# EAGLE design SlideBoard (EAGLE 7.5.0)
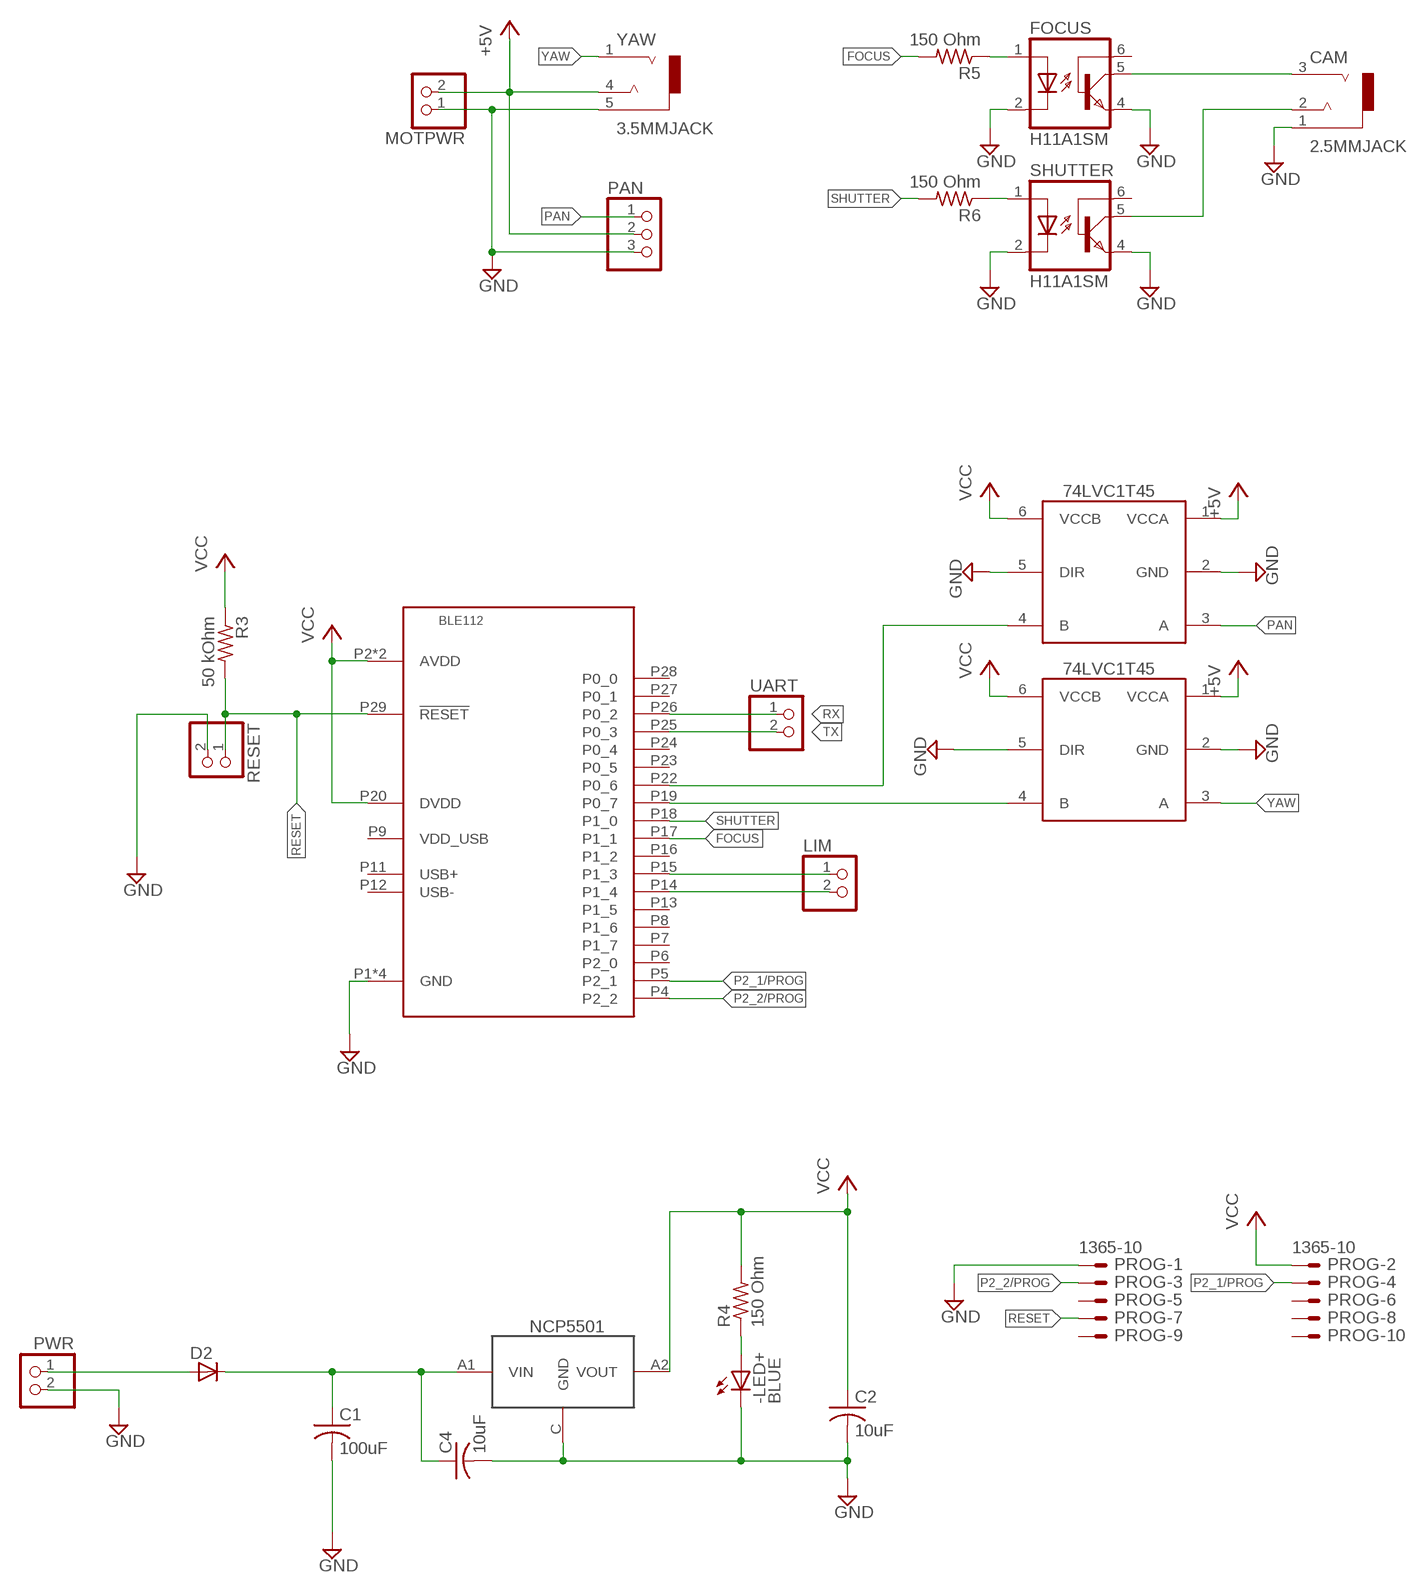
[diagram p0: schematic, sheet 1]

## Parts
-LED+  BLUE  LEDCHIP-LED0603  [CHIP-LED0603]
C1  100uF  C-USC1210  [C1210]
C2  10uF  C-USC0805  [C0805]
C4  10uF  C-USC0805  [C0805]
CAM  2.5MMJACK  [2.5MMJACK]
D2  D-A1-C3  [SOT23]
FOCUS  H11A1SM  [DIL6-SMD]
LIM  PINHD-1X2  [1X02]
MOTPWR  PINHD-1X2  [1X02]
PAN  PINHD-1X3  [1X03]
PROG  1365-10  [1365-10]
PWR  PINHD-1X2  [1X02]
R3  50 kOhm  R-US_R0603  [R0603]
R4  150 Ohm  R-US_R0402  [R0402]
R5  150 Ohm  R-US_R0402  [R0402]
R6  150 Ohm  R-US_R0402  [R0402]
RESET  PINHD-1X2  [1X02]
SHUTTER  H11A1SM  [DIL6-SMD]
U$1  BLE112  [BLE112]
U$2  741T45  [SOT363_PHILIPS]
U$3  NCP5501  [DPACK_3]
U$4  741T45  [SOT363_PHILIPS]
UART  PINHD-1X2  [1X02]
YAW  3.5MMJACK  [35RA_SMT]

## Nets
+5V: MOTPWR.2 PAN.2 U$2.1(VCCA) U$4.1(VCCA) YAW.4
FOCUS: R5.2 U$1.P17(P1_1)
GND: -LED+.C C1.2 C2.2 C4.2 CAM.1(5-GND) FOCUS.2(C) FOCUS.4(EMI) MOTPWR.1 PAN.3 PROG.1 PWR.2 RESET.2 SHUTTER.2(C) SHUTTER.4(EMI) U$1.P1(GND) U$1.P10(GND) U$1.P21(GND) U$1.P30(GND) U$2.2(GND) U$2.5(DIR) U$3.C(GND) U$4.2(GND) U$4.5(DIR) YAW.5(5-GND)
N$1: D2.1(A) PWR.1
N$2: FOCUS.1(A) R5.1
N$3: R6.1 SHUTTER.1(A)
N$4: CAM.2 SHUTTER.5(COL)
N$5: CAM.3 FOCUS.5(COL)
N$6: LIM.1 U$1.P15(P1_3)
N$7: -LED+.A R4.1
N$8: LIM.2 U$1.P14(P1_4)
N$9: U$1.P19(P0_7) U$4.4(B)
N$10: C1.1 C4.1 D2.3(C) U$3.A1(VIN)
P2_1/PROG: PROG.4 U$1.P5(P2_1)
P2_2/PROG: PROG.3 U$1.P4(P2_2)
PAN: PAN.1 U$2.3(A)
RESET: PROG.7 R3.2 RESET.1 U$1.P29(!RESET)
RX: U$1.P26(P0_2) UART.1
SHUTTER: R6.2 U$1.P18(P1_0)
TX: U$1.P25(P0_3) UART.2
VCC: C2.1 PROG.2 R3.1 R4.2 U$1.P2(AVDD) U$1.P3(AVDD) U$1.P20(DVDD) U$2.6(VCCB) U$3.A2(VOUT) U$4.6(VCCB)
YAW: U$4.3(A) YAW.1
YAW_LOW: U$1.P22(P0_6) U$2.4(B)
Unconnected: FOCUS.6(BAS) PROG.5 PROG.6 PROG.8 PROG.9 PROG.10 SHUTTER.6(BAS) U$1.P6(P2_0) U$1.P7(P1_7) U$1.P8(P1_6) U$1.P9(VDD_USB) U$1.P11(USB+) U$1.P12(USB-) U$1.P13(P1_5) U$1.P16(P1_2) U$1.P23(P0_5) U$1.P24(P0_4) U$1.P27(P0_1) U$1.P28(P0_0)

## Library data of the parts
-LED+ = led:LED: LED OSRAM: - CHIPLED LG R971, LG N971, LY N971, LG Q971, LY Q971, LO R971, LY R971 LH N974, LH R974 LS Q976, LO Q976, LY Q976 LO Q996 - Hyper CHIPLED LW Q18S LB Q993, LB Q99A, LB R99A - SideLED LS A670, LO A670, LY A670, LG A670, LP A670 LB A673, LV A673, LT A673, LW A673 LH A674 LY A675 LS A676, LA A676, LO A676, LY A676, LW A676 LS A679, LY A679, LG A679 - Hyper Micro SIDELED® LS Y876, LA Y876, LO Y876, LY Y876 LT Y87S - SmartLED LW L88C, LW L88S LB L89C, LB L89S, LG L890 LS L89K, LO L89K, LY L89K LS L896, LA L896, LO L896, LY L896 - TOPLED LS T670, LO T670, LY T670, LG T670, LP T670 LSG T670, LSP T670, LSY T670, LOP T670, LYG T670 LG T671, LOG T671, LSG T671 LB T673, LV T673, LT T673, LW T673 LH T674 LS T676, LA T676, LO T676, LY T676, LB T676, LH T676, LSB T676, LW T676 LB T67C, LV T67C, LT T67C, LS T67K, LO T67K, LY T67K, LW E67C LS E67B, LA E67B, LO E67B, LY E67B, LB E67C, LV E67C, LT E67C LW T67C LS T679, LY T679, LG T679 LS T770, LO T770, LY T770, LG T770, LP T770 LB T773, LV T773, LT T773, LW T773 LH T774 LS E675, LA E675, LY E675, LS T675 LS T776, LA T776, LO T776, LY T776, LB T776 LHGB T686 LT T68C, LB T68C - Hyper Mini TOPLED® LB M676 - Mini TOPLED Santana® LG M470 LS M47K, LO M47K, LY M47K Source: http://www.osram.convergy.de LUXEON: - LUMILED® LXK2-PW12-R00, LXK2-PW12-S00, LXK2-PW14-U00, LXK2-PW14-V00 LXK2-PM12-R00, LXK2-PM12-S00, LXK2-PM14-U00 LXK2-PE12-Q00, LXK2-PE12-R00, LXK2-PE12-S00, LXK2-PE14-T00, LXK2-PE14-U00 LXK2-PB12-K00, LXK2-PB12-L00, LXK2-PB12-M00, LXK2-PB14-N00, LXK2-PB14-P00, LXK2-PB14-Q00 LXK2-PR12-L00, LXK2-PR12-M00, LXK2-PR14-Q00, LXK2-PR14-R00 LXK2-PD12-Q00, LXK2-PD12-R00, LXK2-PD12-S00 LXK2-PH12-R00, LXK2-PH12-S00 LXK2-PL12-P00, LXK2-PL12-Q00, LXK2-PL12-R00 Source: www.luxeon.com KINGBRIGHT: KA-3528ASYC Source: www.kingbright.com
C1 C2 C4 = rcl:C-US: CAPACITOR, American symbol
CAM = Random:2.5MMJACK
D2 = semicon-smd-ipc:D-: DIODE unfilled
FOCUS SHUTTER = optocoupler:H11A*?M: General Purpose 6-Pin Phototransistor Optocouplers Source: http://www.fairchildsemi.com/ds/4N/4N35-M.pdf; OC_FARNELL: unknown; OC_NEWARK: unknown
LIM MOTPWR PWR RESET UART = pinhead:PINHD-1X2: PIN HEADER
PAN = pinhead:PINHD-1X3: PIN HEADER
PROG = con-leotronics:1365-10: DUAL ROW STRAIGHT HEADER 1364 SERIES. 1.27mm x 1.27mm. Without Fixing Post. SMT Source: http://www.leotronics.co.uk/Conexcon/Data%20Sheets/sec.%20A/1364ing.pdf; OC_FARNELL: unknown; OC_NEWARK: unknown
R3 = rcl:R-US_: RESISTOR, American symbol
R4-R6 = resistor:R-US_: RESISTOR, American symbol
U$1 = temp:BLE112
U$2 U$4 = Random:74*1T45
U$3 = Random:NCP5501
YAW = Random:3.5MMJACK

## Board
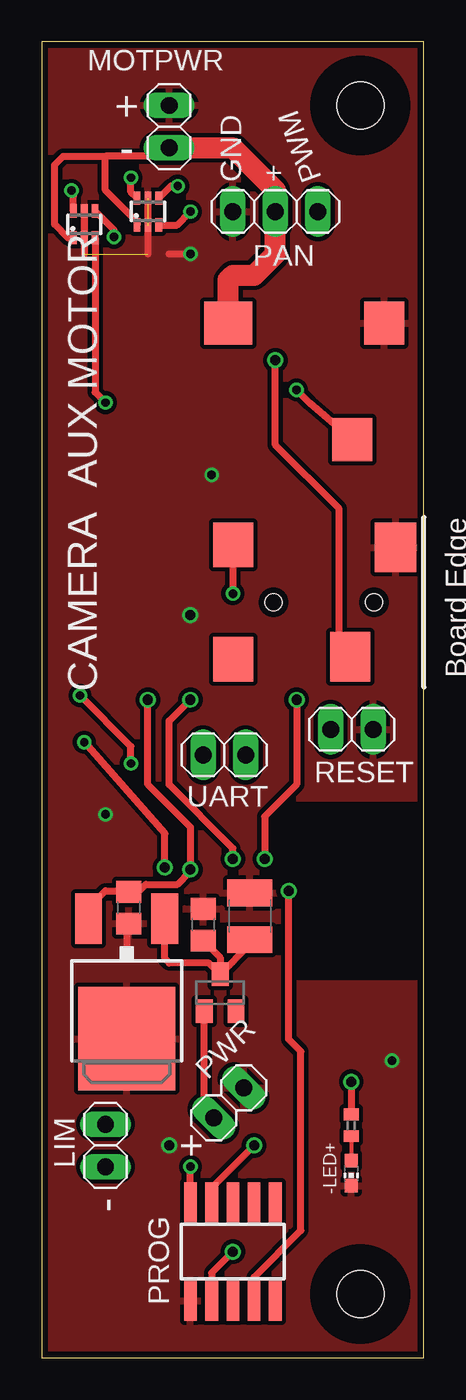
[diagram p1: board, top side]
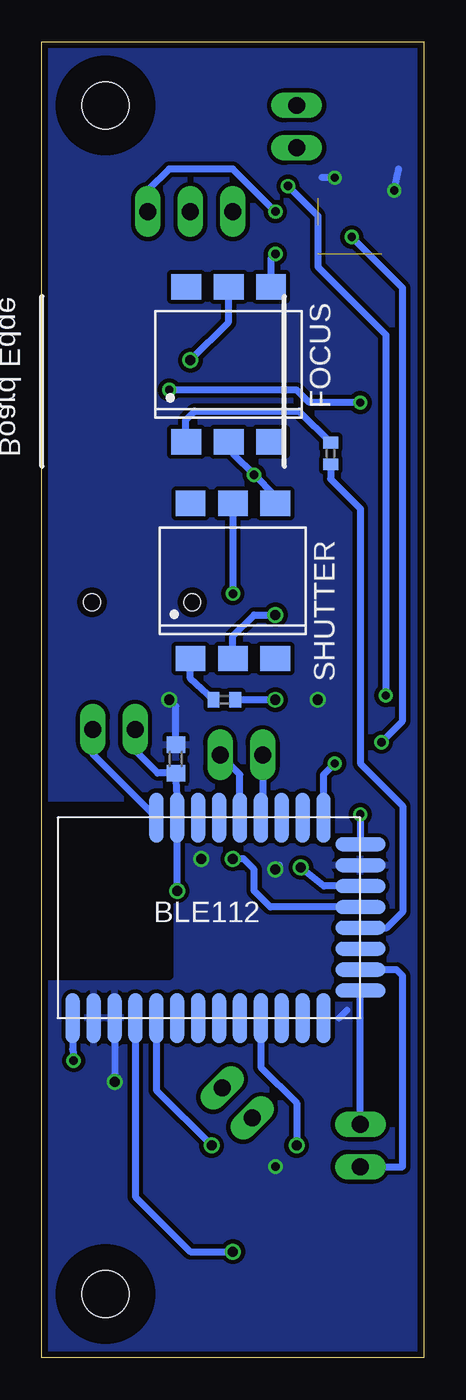
[diagram p2: board, bottom side, seen from below]

Size 22.86 x 78.74 mm. Coordinates in mm from the lower left corner, seen from the top.
Outline: 0,0 22.86,0 22.86,78.74 0,78.74 0,0
Copper layers (1*16): Top 0.0356mm / dielectric 1.5011mm / Bottom 0.0356mm
Design rules "LaenPCBOrder": minimum track width 6mil, minimum drill 13mil, track to track 6mil, track to pad 6mil, pad to pad 6mil, via to via 6mil, smd to smd 6mil, copper to edge 15mil, drill to drill 6mil, minimum pad ring 7mil, minimum via ring 7mil, stop-mask expansion 3mil, vias tented up to drill 0mil, thermal gap 10mil
Holes 2.8 mm at 19.05,74.93 19.05,3.81
tRestrict: area 17.3,73.2 to 20.8,76.7; area 17.3,2 to 20.8,5.6; area 15.2,22.9 to 22.9,33
bRestrict: area 17.3,73.2 to 20.8,76.7; area 17.3,2 to 20.8,5.6; area 15.2,22.9 to 22.9,33

### Footprints (pad centres in the part's own frame; a part is rotated, then mirrored left to right if it is on the bottom)
CHIP-LED0603 = smd 0.8 x 0.8: A 0,-0.75; C 0,0.75
C1210 = smd 1.6 x 2.7: 1 -1.4,0; 2 1.4,0
C0805 = smd 1.3 x 1.5: 1 -0.95,0; 2 0.95,0
2.5MMJACK = smd 2.46 x 2.95: 1 1.7,-3.275 | smd 2.4 x 2.65: 2 11.4,-3.425; 4 11.4,3.425 | smd 2.4 x 2.95: 3 4.4,3.275 | hole 1: 3,0; 9,0
SOT23 = smd 1 x 1.4: 1 -0.95,-1.1; 2 0.95,-1.1; 3 0,1.1
DIL6-SMD = smd 1.78 x 1.52: 1 -2.54,-4.645; 2 0,-4.645; 3 2.54,-4.645; 4 2.54,4.645; 5 0,4.645; 6 -2.54,4.645
1X02 = drill 1.016 long: 1 -1.27,0; 2 1.27,0
1X03 = drill 1.016 long: 1 -2.54,0; 2 0,0; 3 2.54,0
1365-10 = smd 0.76 x 2.4: 1 -2.54,-2.95; 2 -2.54,2.95; 3 -1.27,-2.95; 4 -1.27,2.95; 5 0,-2.95; 6 0,2.95; 7 1.27,-2.95; 8 1.27,2.95; 9 2.54,-2.95; 10 2.54,2.95
R0603 = smd 1 x 1.1: 1 -0.85,0; 2 0.85,0
R0402 = smd 0.7 x 0.9: 1 -0.65,0; 2 0.65,0
BLE112 = smd 3 x 0.85: P1 0,17.2; P2 0,15.95; P3 0,14.7; P4 0,13.45; P5 0,12.2; P6 0,10.95; P7 0,9.7; P8 0,8.45; P9 0,7.2; P10 0,5.95; P11 0,4.7; P12 0,3.45; P13 0,2.2; P22 12,2.2; P23 12,3.45; P24 12,4.7; P25 12,5.95; P26 12,7.2; P27 12,8.45; P28 12,9.7; P29 12,10.95; P30 12,12.2 | smd 0.85 x 3: P14 1.65,0; P15 2.9,0; P16 4.15,0; P17 5.4,0; P18 6.65,0; P19 7.9,0; P20 9.15,0; P21 10.4,0
SOT363_PHILIPS = smd 0.4 x 0.8: 1 -0.65,-0.8; 2 0,-0.8; 3 0.65,-0.8; 4 0.65,0.8; 5 0,0.8; 6 -0.65,0.8
DPACK_3 = smd 1.6 x 3: A1 -2.28,-4.68; A2 2.28,-4.68 | smd 5.8 x 6.2: C 0,2.5
35RA_SMT = smd 2.388 x 2.553: 1 4.293,3.486; 5 2.388,-3.486 | smd 2.896 x 2.553: 4 11.709,-3.486

### Placement (x,y rotation side)
-LED+  18.51,11.05 180 top
C1  12.45,26.42 90 top
C2  5.21,26.92 270 top
C4  9.65,25.91 90 top
CAM  22.86,45.21 180 top
D2  10.67,21.84 0 top
FOCUS  11.68,59.44 0 bottom
LIM  3.81,12.7 90 top
MOTPWR  7.62,73.66 270 top
PAN  13.97,68.58 180 top
PROG  11.43,6.35 0 top
PWR  11.18,15.24 45 top
R3  14.84,35.83 270 bottom
R4  18.51,13.91 90 top
R5  5.59,54.1 270 bottom
R6  11.94,39.37 0 bottom
RESET  18.54,37.59 0 top
SHUTTER  11.43,46.48 0 bottom
U$1  3.81,20.32 90 bottom
U$2  6.35,68.58 0 top
U$3  5.08,21.59 180 top
U$4  2.54,67.82 0 top
UART  10.92,36.07 180 top
YAW  22.86,58.42 180 top

### Tracks (layer width: path | path; a pad name or v marks a point on that pad's centre or on a via)
+5V
  Top 0.406: 3.81,71.88 7.11,71.88 MOTPWR.2 | U$2.1 5.7,67.96 3.81,69.85 3.81,71.88 | U$4.1 1.56,67.02 0.76,67.82 0.76,71.37 1.27,71.88 3.81,71.88
  Top 1.27: MOTPWR.2 11.43,72.39 13.97,69.85 PAN.2 13.97,66.04 12.7,64.77 11.43,64.77 11.15,64.49 YAW.4
FOCUS
  Bottom 0.406: R5.2 5.59,52.58 3.81,50.8 3.81,35.56 1.27,33.02 1.27,26.67 2.22,25.72 U$1.P17
GND  (via drill 0.5, 0.6)  (2 unrouted)
  Top 0.254: 3.81,18.03 3.81,17.78
  Top 0.406: U$3.C 3.81,17.82 3.81,17.78 | U$2.5 6.35,66.04 | v8.89,66.04 7.62,66.04 | U$4.5 U$4.2 2.54,66.04 | C2.2 5.08,25.85 5.08,24.13
  Bottom 0.406: SHUTTER.2 11.43,43.18 10.16,44.45 v8.89,44.45 | SHUTTER.4 8.89,51.56 v10.16,52.83 11.43,54.1 11.43,54.54 FOCUS.2 | FOCUS.4 9.14,65.79 v8.89,66.04 | U$1.P1 21.01,18.47 v20.95,17.78 | U$1.P30 19.81,36.12 RESET.2 | U$1.P10 9.76,17.38 7.62,15.24 v7.62,12.7 | v3.81,32.51 U$1.P21
  pour Top (isolate 0.254): 0,0 0,78.74 22.86,78.74 22.86,0
N$1
  Top 0.406: PWR.1 9.72,14.9 D2.1
N$2
  Bottom 0.406: FOCUS.1 14.26,54.75 14.26,56.1 13.72,56.64 7.48,56.64 R5.1
N$3
  Bottom 0.406: R6.1 13.97,40.64 SHUTTER.1
N$4  (via drill 0.5)
  Top 0.406: CAM.2 11.43,48.61 v11.43,45.72
  Bottom 0.406: SHUTTER.5 v11.43,45.72
N$5  (via drill 0.6)
  Top 0.406: CAM.3 17.78,42.62 17.78,50.8 13.97,54.61 v13.97,59.69
  Bottom 0.406: FOCUS.5 11.68,61.98 v13.97,59.69
N$6
  Bottom 0.406: LIM.1 1.27,11.43 1.27,22.86 1.63,23.22 U$1.P15
N$7
  Top 0.254: R4.1 -LED+.A
N$8
  Bottom 0.406: LIM.2 U$1.P14
N$9  (via drill 0.5, 0.6)
  Top 0.406: U$4.4 4.32,67.49 v4.32,67.06 | v7.37,29.34 7.37,31.37 v2.54,36.83
  Bottom 0.406: v4.32,67.06 1.27,64.01 1.27,38.1 v2.54,36.83 | U$1.P19 6,28.22 v7.37,29.34
N$10
  Top 0.406: D2.3 9.99,23.62 7.62,23.62 7.36,23.88 U$3.A1 | D2.3 12.45,24.72 C1.1 | C4.1 10.67,23.94 D2.3
P2_1/PROG  (via drill 0.6)
  Top 0.406: PROG.4 10.16,10.16 v12.7,12.7
  Bottom 0.406: U$1.P5 16.01,16.01 v12.7,12.7
P2_2/PROG  (via drill 0.6)
  Top 0.406: v11.43,6.35 10.16,5.08 PROG.3
  Bottom 0.406: U$1.P4 17.26,9.64 13.97,6.35 v11.43,6.35
PAN  (via drill 0.5)
  Top 0.406: U$2.3 8.09,67.78 v8.89,68.58
  Bottom 0.406: v8.89,68.58 11.43,71.12 15.24,71.12 16.51,69.85 PAN.1
RESET  (via drill 0.6)
  Top 0.406: PROG.7 12.7,4.83 15.49,7.62 15.49,18.32 14.76,19.05 v14.76,27.94
  Bottom 0.406: RESET.1 17.27,36.32 15.93,34.98 R3.2 14.76,33.63 U$1.P29 v14.76,27.94
RX
  Bottom 0.406: U$1.P26 11.01,34.89 UART.1
SHUTTER  (via drill 0.6)
  Top 0.406: v11.43,29.84 11.43,30.48 7.62,34.29 7.62,38.1 v8.89,39.37
  Bottom 0.406: v8.89,39.37 R6.2 | U$1.P18 9.19,26.97 10.16,27.94 10.16,29.21 10.79,29.84 v11.43,29.84
TX
  Bottom 0.406: UART.2 9.65,32.43 U$1.P25
VCC  (via drill 0.5, 0.6)
  Top 0.406: PROG.2 v8.89,11.43 | U$2.6 5.33,69.75 v5.33,70.61 | U$4.6 1.89,69.48 v1.78,69.85 | v18.51,16.51 R4.2 | U$3.A2 2.8,26.93 3.81,27.94 5.14,27.94 C2.1 | v15.24,39.37 15.24,34.29 13.34,32.38 v13.34,29.84 | v6.35,39.37 6.35,34.29 8.89,31.75 v8.89,29.21 8.89,29.08 8.13,28.32 6.22,28.32 5.78,27.87 C2.1 | C2.1 5.27,27.94
  Bottom 0.406: 4.61,20.79 5.08,20.32 | v5.33,70.61 6.1,70.61 | v1.78,69.85 1.52,71.12 | U$1.P3 v18.51,16.51 | v8.89,29.21 8.63,29.47 | R3.1 14.84,38.97 v15.24,39.37
  pour Bottom (isolate 0.254): 0,0 0,78.74 22.86,78.74 22.86,0
YAW  (via drill 0.5)
  Top 0.406: U$4.3 3.19,57.77 v3.81,57.15 | v15.24,57.91 16.03,57.12 YAW.1
  Bottom 0.406: v3.81,57.15 6.86,57.15 7.62,57.91 v15.24,57.91
YAW_LOW  (via drill 0.5)
  Top 0.406: U$2.4 7.72,70.1 v8.13,70.1 | v5.33,35.56 5.33,36.58 v2.29,39.62
  Bottom 0.406: v8.13,70.1 6.35,68.33 6.35,65.28 2.29,61.21 v2.29,39.62 | U$1.P22 6.01,34.88 v5.33,35.56

### Text on the board
tNames: + | - | GND | + | PWM | AUX MOTOR | CAMERA | + | -